# Altium schematic sheet 15.RK3568_SARADCGPIO.SchDoc
size 420 x 297 mm
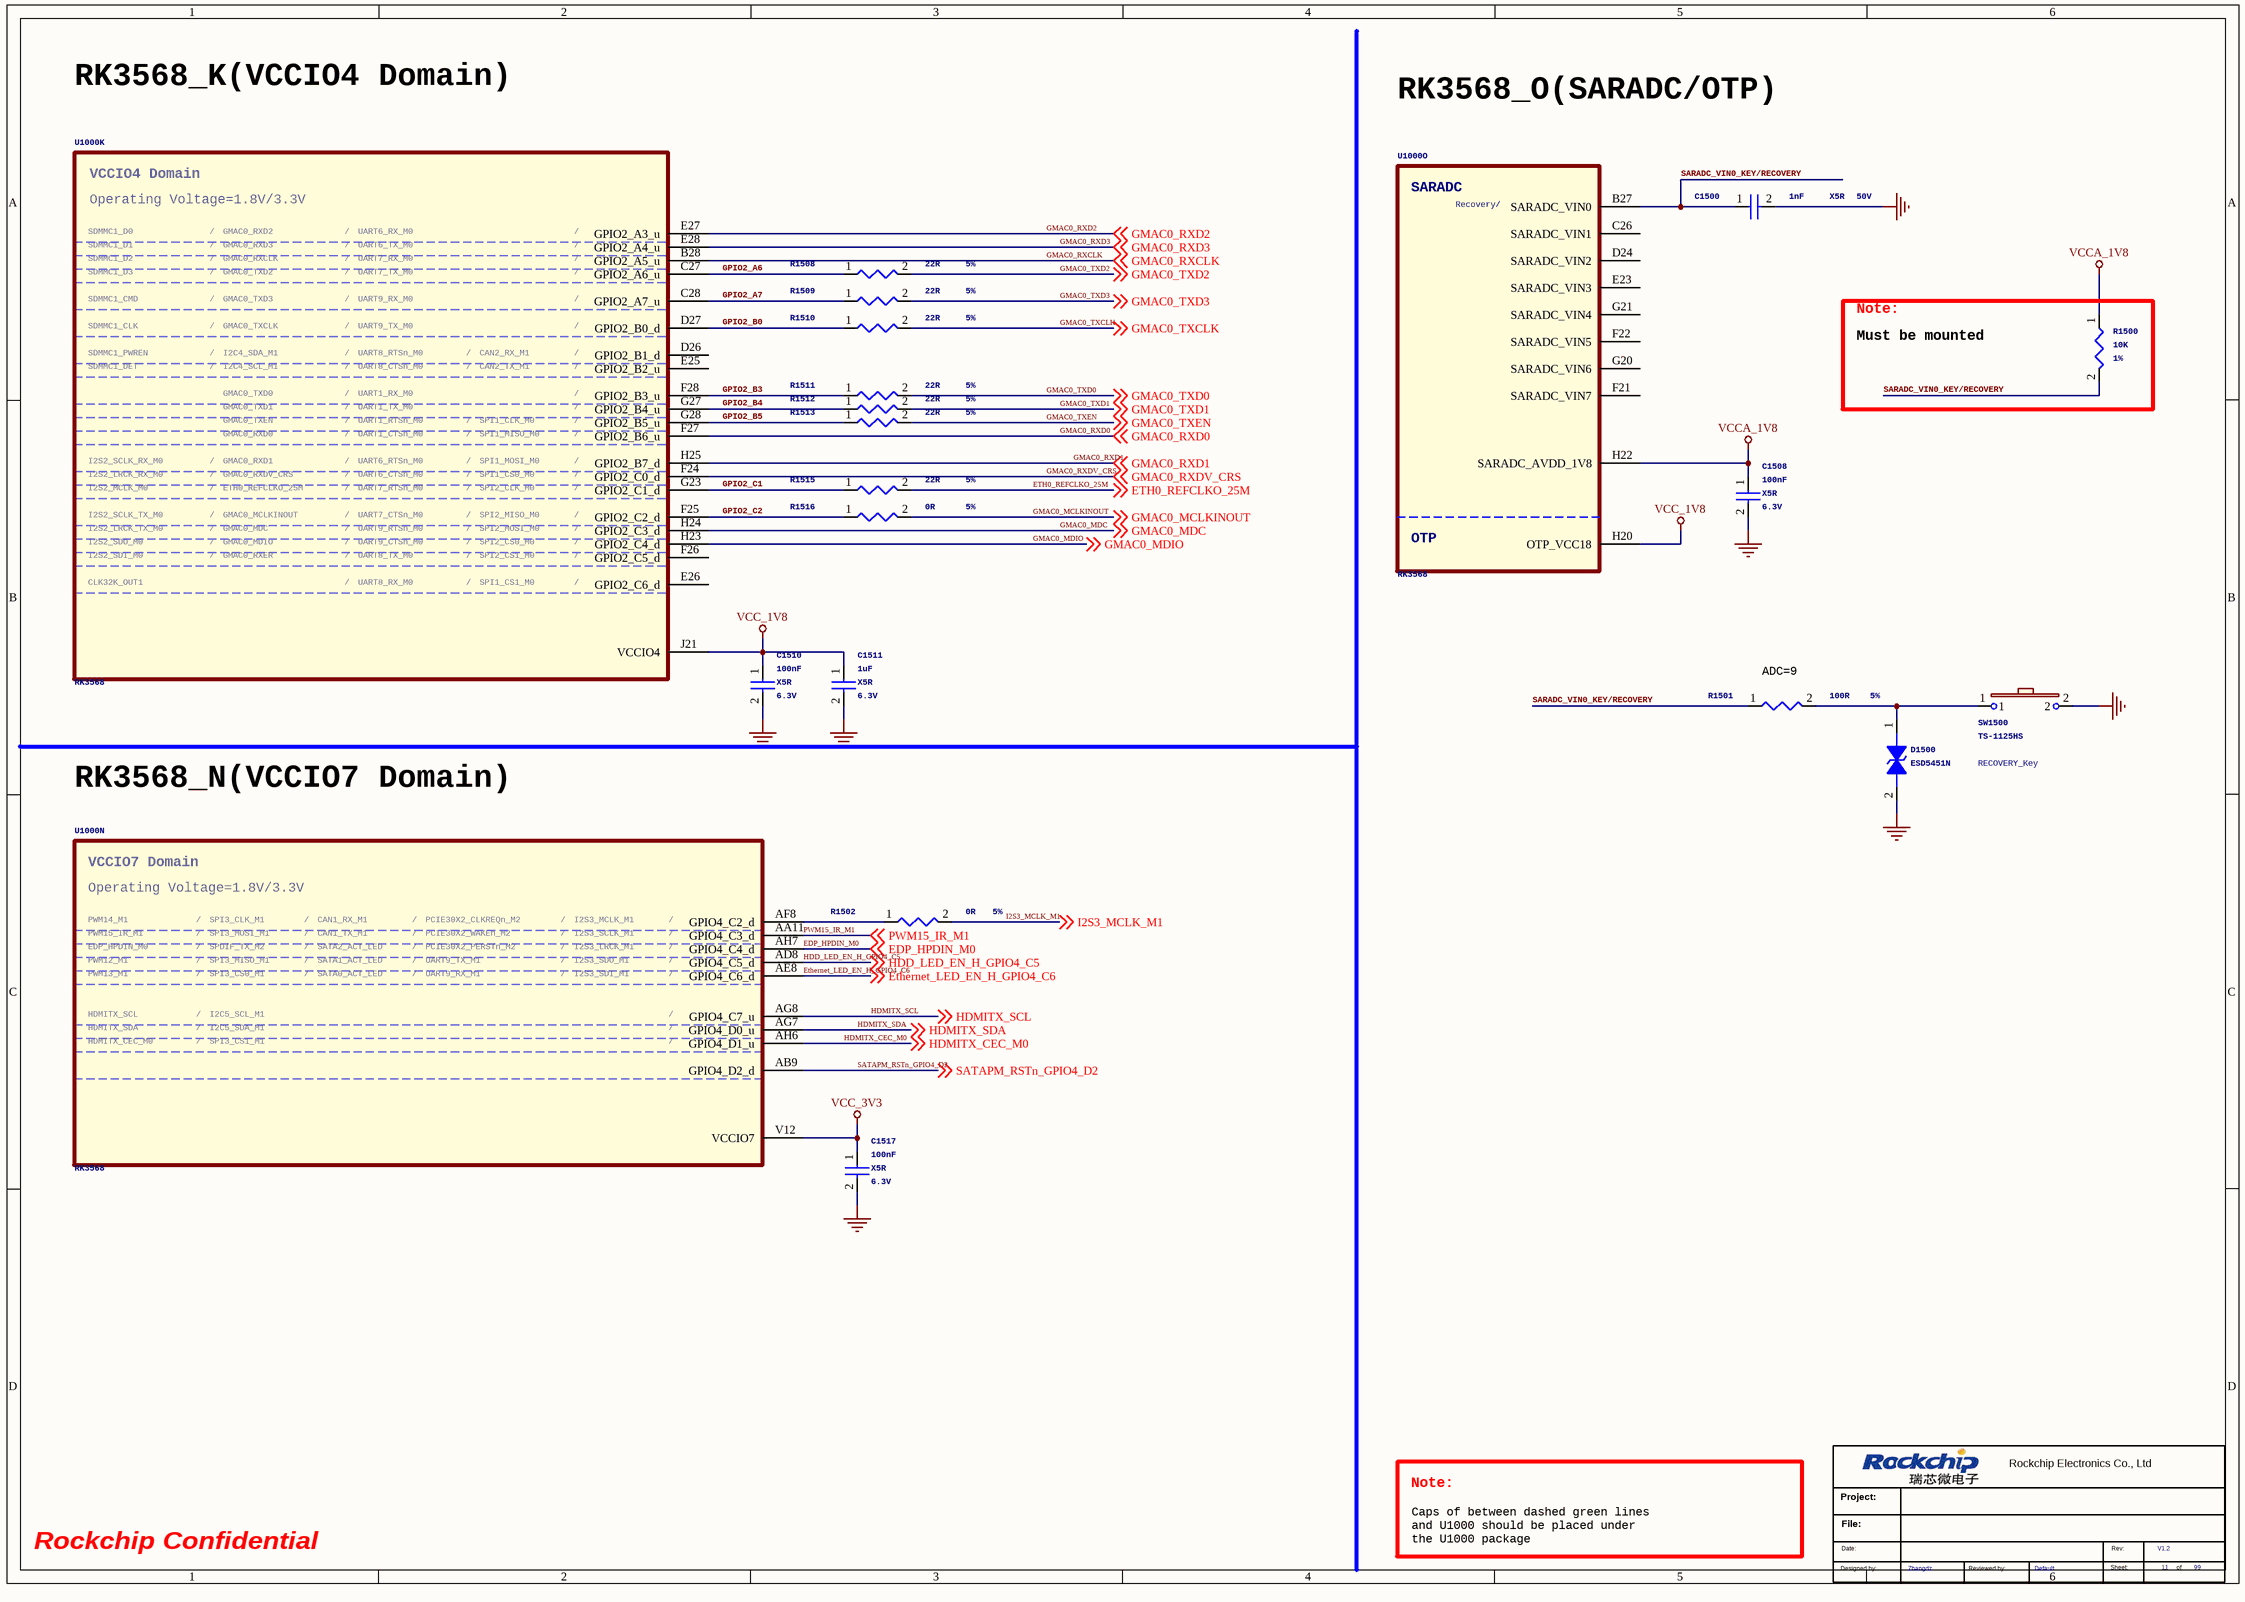
[diagram p0: 15.RK3568_SARADCGPIO.SchDoc]

## Parts
*  Schematic Page Count: 99  Schematic Page Number: 11  Designer: Zhangdz  Revision: V1.2  Check: Default  (hidden comment: Rockchip_new)  (graphical)
C1500  1nF  Voltage: 50V  Dielectric: X5R  [C0402]
C1508  100nF  Voltage: 6.3V  Dielectric: X5R  [C0201]
C1510  100nF  Voltage: 6.3V  Dielectric: X5R  [C0201]
C1511  1uF  Voltage: 6.3V  Dielectric: X5R  [C0402]
C1517  100nF  Voltage: 6.3V  Dielectric: X5R  [C0201]
D1500  ESD5451N  [ESD0402]
R1500  10K  Tolerance: 1%  [R0402]
R1501  100R  Tolerance: 5%  [R0402]
R1502  0R  Tolerance: 5%  [R0402]
R1508  22R  Tolerance: 5%  [R0402]
R1509  22R  Tolerance: 5%  [R0402]
R1510  22R  Tolerance: 5%  [R0402]
R1511  22R  Tolerance: 5%  [R0402]
R1512  22R  Tolerance: 5%  [R0402]
R1513  22R  Tolerance: 5%  [R0402]
R1515  22R  Tolerance: 5%  [R0402]
R1516  0R  Tolerance: 5%  [R0402]
SW1500  TS-1125HS  Option: RECOVERY_Key  [SW2_6R00X3R70X2R50]
U1000  RK3568  [BGA636_19R00X19R00X1R20]  (parts K,N,O of 23)

## Nets
GND: C1500.2 C1508.2 C1510.2 C1511.2 C1517.2 D1500.2 SW1500.2
VCC_1V8: C1510.1 C1511.1 U1000.H20(OTP_VCC18) U1000.J21(VCCIO4)
VCC_3V3: C1517.1 U1000.V12(VCCIO7)
VCCA_1V8: C1508.1 R1500.1 U1000.H22(SARADC_AVDD_1V8)
EDP_HPDIN_M0: U1000.AH7(GPIO4_C4_d) ; off-sheet EDP_HPDIN_M0
ETH0_REFCLKO_25M: R1515.2 ; off-sheet ETH0_REFCLKO_25M
Ethernet_LED_EN_H_GPIO4_C6: U1000.AE8(GPIO4_C6_d) ; off-sheet Ethernet_LED_EN_H_GPIO4_C6
GMAC0_MCLKINOUT: R1516.2 ; off-sheet GMAC0_MCLKINOUT
GMAC0_MDC: U1000.H24(GPIO2_C3_d) ; off-sheet GMAC0_MDC
GMAC0_MDIO: U1000.H23(GPIO2_C4_d) ; off-sheet GMAC0_MDIO
GMAC0_RXCLK: U1000.B28(GPIO2_A5_u) ; off-sheet GMAC0_RXCLK
GMAC0_RXD0: U1000.F27(GPIO2_B6_u) ; off-sheet GMAC0_RXD0
GMAC0_RXD1: U1000.H25(GPIO2_B7_d) ; off-sheet GMAC0_RXD1
GMAC0_RXD2: U1000.E27(GPIO2_A3_u) ; off-sheet GMAC0_RXD2
GMAC0_RXD3: U1000.E28(GPIO2_A4_u) ; off-sheet GMAC0_RXD3
GMAC0_RXDV_CRS: U1000.F24(GPIO2_C0_d) ; off-sheet GMAC0_RXDV_CRS
GMAC0_TXCLK: R1510.2 ; off-sheet GMAC0_TXCLK
GMAC0_TXD0: R1511.2 ; off-sheet GMAC0_TXD0
GMAC0_TXD1: R1512.2 ; off-sheet GMAC0_TXD1
GMAC0_TXD2: R1508.2 ; off-sheet GMAC0_TXD2
GMAC0_TXD3: R1509.2 ; off-sheet GMAC0_TXD3
GMAC0_TXEN: R1513.2 ; off-sheet GMAC0_TXEN
GPIO2_A6: R1508.1 U1000.C27(GPIO2_A6_u)
GPIO2_A7: R1509.1 U1000.C28(GPIO2_A7_u)
GPIO2_B0: R1510.1 U1000.D27(GPIO2_B0_d)
GPIO2_B3: R1511.1 U1000.F28(GPIO2_B3_u)
GPIO2_B4: R1512.1 U1000.G27(GPIO2_B4_u)
GPIO2_B5: R1513.1 U1000.G28(GPIO2_B5_u)
GPIO2_C1: R1515.1 U1000.G23(GPIO2_C1_d)
GPIO2_C2: R1516.1 U1000.F25(GPIO2_C2_d)
HDD_LED_EN_H_GPIO4_C5: U1000.AD8(GPIO4_C5_d) ; off-sheet HDD_LED_EN_H_GPIO4_C5
HDMITX_CEC_M0: U1000.AH6(GPIO4_D1_u) ; off-sheet HDMITX_CEC_M0
HDMITX_SCL: U1000.AG8(GPIO4_C7_u) ; off-sheet HDMITX_SCL
HDMITX_SDA: U1000.AG7(GPIO4_D0_u) ; off-sheet HDMITX_SDA
I2S3_MCLK_M1: R1502.2 ; off-sheet I2S3_MCLK_M1
PWM15_IR_M1: U1000.AA11(GPIO4_C3_d) ; off-sheet PWM15_IR_M1
SARADC_VIN0_KEY/RECOVERY: C1500.1 R1500.2 R1501.1 U1000.B27(SARADC_VIN0)
SATAPM_RSTn_GPIO4_D2: U1000.AB9(GPIO4_D2_d) ; off-sheet SATAPM_RSTn_GPIO4_D2
NetD1500_1: D1500.1 R1501.2 SW1500.1
NetR1502_1: R1502.1 U1000.AF8(GPIO4_C2_d)

Not connected (* = marked no-connect by the designer): U1000 C26(SARADC_VIN1) D24(SARADC_VIN2) D26(GPIO2_B1_d) E23(SARADC_VIN3) E25(GPIO2_B2_u) E26(GPIO2_C6_d) F21(SARADC_VIN7) F22(SARADC_VIN5) F26(GPIO2_C5_d) G20(SARADC_VIN6) G21(SARADC_VIN4)

## Notes on the sheet
- RK3568_K(VCCIO4 Domain)
- RK3568_O(SARADC/OTP)
- Note:
- Must be mounted
- (near R1501) ADC=9
- RK3568_N(VCCIO7 Domain)
- Rockchip Confidential
- Caps of between dashed green lines
  and U1000 should be placed under
  the U1000 package
- (in symbol Rockchip_new) Rockchip Electronics Co., Ltd; Project:; File:; Date:; Rev:; Sheet:; of; Designed by:; Reviewed by:
- (in symbol SOC_RK3568, part K) VCCIO4 Domain; Operating Voltage=1.8V/3.3V; SDMMC1_D0; /; GMAC0_RXD2; UART6_RX_M0; SDMMC1_D1; GMAC0_RXD3; UART6_TX_M0; SDMMC1_D2; GMAC0_RXCLK; UART7_RX_M0; SDMMC1_D3; GMAC0_TXD2; UART7_TX_M0; SDMMC1_CMD; GMAC0_TXD3; UART9_RX_M0; SDMMC1_CLK; GMAC0_TXCLK; UART9_TX_M0; SDMMC1_PWREN; I2C4_SDA_M1; UART8_RTSn_M0; CAN2_RX_M1; SDMMC1_DET; I2C4_SCL_M1; UART8_CTSn_M0; CAN2_TX_M1; GMAC0_TXD0; UART1_RX_M0; GMAC0_TXD1; UART1_TX_M0; GMAC0_TXEN; UART1_RTSn_M0; SPI1_CLK_M0; GMAC0_RXD0; UART1_CTSn_M0; SPI1_MISO_M0; I2S2_SCLK_RX_M0; GMAC0_RXD1; UART6_RTSn_M0; SPI1_MOSI_M0; I2S2_LRCK_RX_M0; GMAC0_RXDV_CRS; UART6_CTSn_M0; SPI1_CS0_M0; I2S2_MCLK_M0; ETH0_REFCLKO_25M; UART7_RTSn_M0; SPI2_CLK_M0; I2S2_SCLK_TX_M0; GMAC0_MCLKINOUT; UART7_CTSn_M0; SPI2_MISO_M0; I2S2_LRCK_TX_M0; GMAC0_MDC; UART9_RTSn_M0; SPI2_MOSI_M0; I2S2_SDO_M0; GMAC0_MDIO; UART9_CTSn_M0; SPI2_CS0_M0; I2S2_SDI_M0; GMAC0_RXER; UART8_TX_M0; SPI2_CS1_M0; CLK32K_OUT1; UART8_RX_M0; SPI1_CS1_M0
- (in symbol SOC_RK3568, part N) VCCIO7 Domain; Operating Voltage=1.8V/3.3V; PWM14_M1; /; SPI3_CLK_M1; CAN1_RX_M1; PCIE30X2_CLKREQn_M2; I2S3_MCLK_M1; PWM15_IR_M1; SPI3_MOSI_M1; CAN1_TX_M1; PCIE30X2_WAKEn_M2; I2S3_SCLK_M1; EDP_HPDIN_M0; SPDIF_TX_M2; SATA2_ACT_LED; PCIE30X2_PERSTn_M2; I2S3_LRCK_M1; PWM12_M1; SPI3_MISO_M1; SATA1_ACT_LED; UART9_TX_M1; I2S3_SDO_M1; PWM13_M1; SPI3_CS0_M1; SATA0_ACT_LED; UART9_RX_M1; I2S3_SDI_M1; HDMITX_SCL; I2C5_SCL_M1; HDMITX_SDA; I2C5_SDA_M1; HDMITX_CEC_M0; SPI3_CS1_M1
- (in symbol SOC_RK3568, part O) SARADC; Recovery/; OTP

## Library data of the parts
* = Rockchip_new: Page Number: 12; Page Count: 37; Revcode: V1.2
C1500 = CAP NP: cap,1.00nF,+/-10%,50V,X5R,C0402; Manufacturer PN: C1005X5R1H102K050BA; Manufacturer: TDK; Tolerance: 10%; Priority: A; Created by: JJJ; Part Type: C0402; RK PN: C1005X5R1H102K050BA
C1508 C1510 C1517 = CAP NP: cap,100.00nF,+/-10%,6.3V,X5R,C0201; Manufacturer PN: C0603X5R0J104K030BC; Manufacturer: TDK; Tolerance: 10%; Priority: A; Created by: JJJ; Part Type: C0201; RK PN: C0603X5R0J104K030BC
C1511 = CAP NP: cap,1.00uF,+/-10%,6.3V,X5R,C0402; Manufacturer: TDK; RK PN: C1005X5R0J105K050BB; Priority: A; Tolerance: 10%; Part Type: C0402; Manufacturer PN: C1005X5R0J105K050BB; Created by: JJJ
D1500 = DIODE BI_DIR TRIG: 1-Line, Bi-directional, Transient Voltage Suppressors.17.5pF.; Manufacturer: WillSemi(韦尔半导体); Priority: A; RK PN: ESD5451N; Part Type: ESD_TVS; Manufacturer PN: ESD5451N; Created by: JJJ
R1500 = RESISTOR: 通用厚膜电阻,10K,+/-1%,R0402,1/16W.; Manufacturer: YAGEO; RK PN: RC0402FR-0710KL; Priority: A; Wattage: 1/16W; Part Type: 通用厚膜电阻; Manufacturer PN: RC0402FR-0710KL; Created by: YTL
R1501 = RESISTOR: 通用厚膜电阻,100R,+/-5%,R0402,1/16W.; Manufacturer: YAGEO; RK PN: RC0402JR-07100RL; Priority: A; Wattage: 1/16W; Part Type: 通用厚膜电阻; Manufacturer PN: RC0402JR-07100RL; Created by: YTL
R1502 R1516 = RESISTOR: 通用厚膜电阻,0R,+/-5%,R0402,1/16W.; Manufacturer: YAGEO; RK PN: RC0402JR-070RL; Priority: A; Wattage: 1/16W; Part Type: 通用厚膜电阻; Manufacturer PN: RC0402JR-070RL; Created by: YTL
R1508-R1510 = RESISTOR: 通用厚膜电阻,22R,+/-5%,R0402,1/16W.; Manufacturer: YAGEO; RK PN: RC0402JR-0722RL; Priority: A; Wattage: 1/16W; Part Type: 通用厚膜电阻; Manufacturer PN: RC0402JR-0722RL; Created by: YTL
R1511-R1513 R1515 = RESISTOR: 通用厚膜电阻,22R,+/-5%,R0402,1/16W.; Manufacturer PN: RC0402JR-0722RL; Manufacturer: YAGEO; Wattage: 1/16W; Priority: A; Created by: YTL; Part Type: 通用厚膜电阻; RK PN: RC0402JR-0722RL
SW1500 = KEY_2PIN: 2脚贴片，6MMx3.7MM按键; Manufacturer: 褀华电子; Priority: A; RK PN: TS-1125HS; Part Type: KEY; Manufacturer Part Number: TS-1125HS; Created by: YWQ
U1000 = SOC_RK3568: ROCKCHIP SOC; Manufacturer: Rockchip (瑞芯微); SPLIT_INST: TRUE; SWAP_INFO: (S1+S2+S3+S4+S5+S6+S7+S8+S9+S10+S11+S12+S13+S14+S15+S16+S17+S18+S19+S20+S21+S22+S23); Priority: A; Created by: JJJ; Manufacturer PN: RK3568; Part Type: SOC; RK PN: RK3568